# EAGLE design synth-zodiac-scorpio-kbd-mcu (EAGLE 9.6.2)
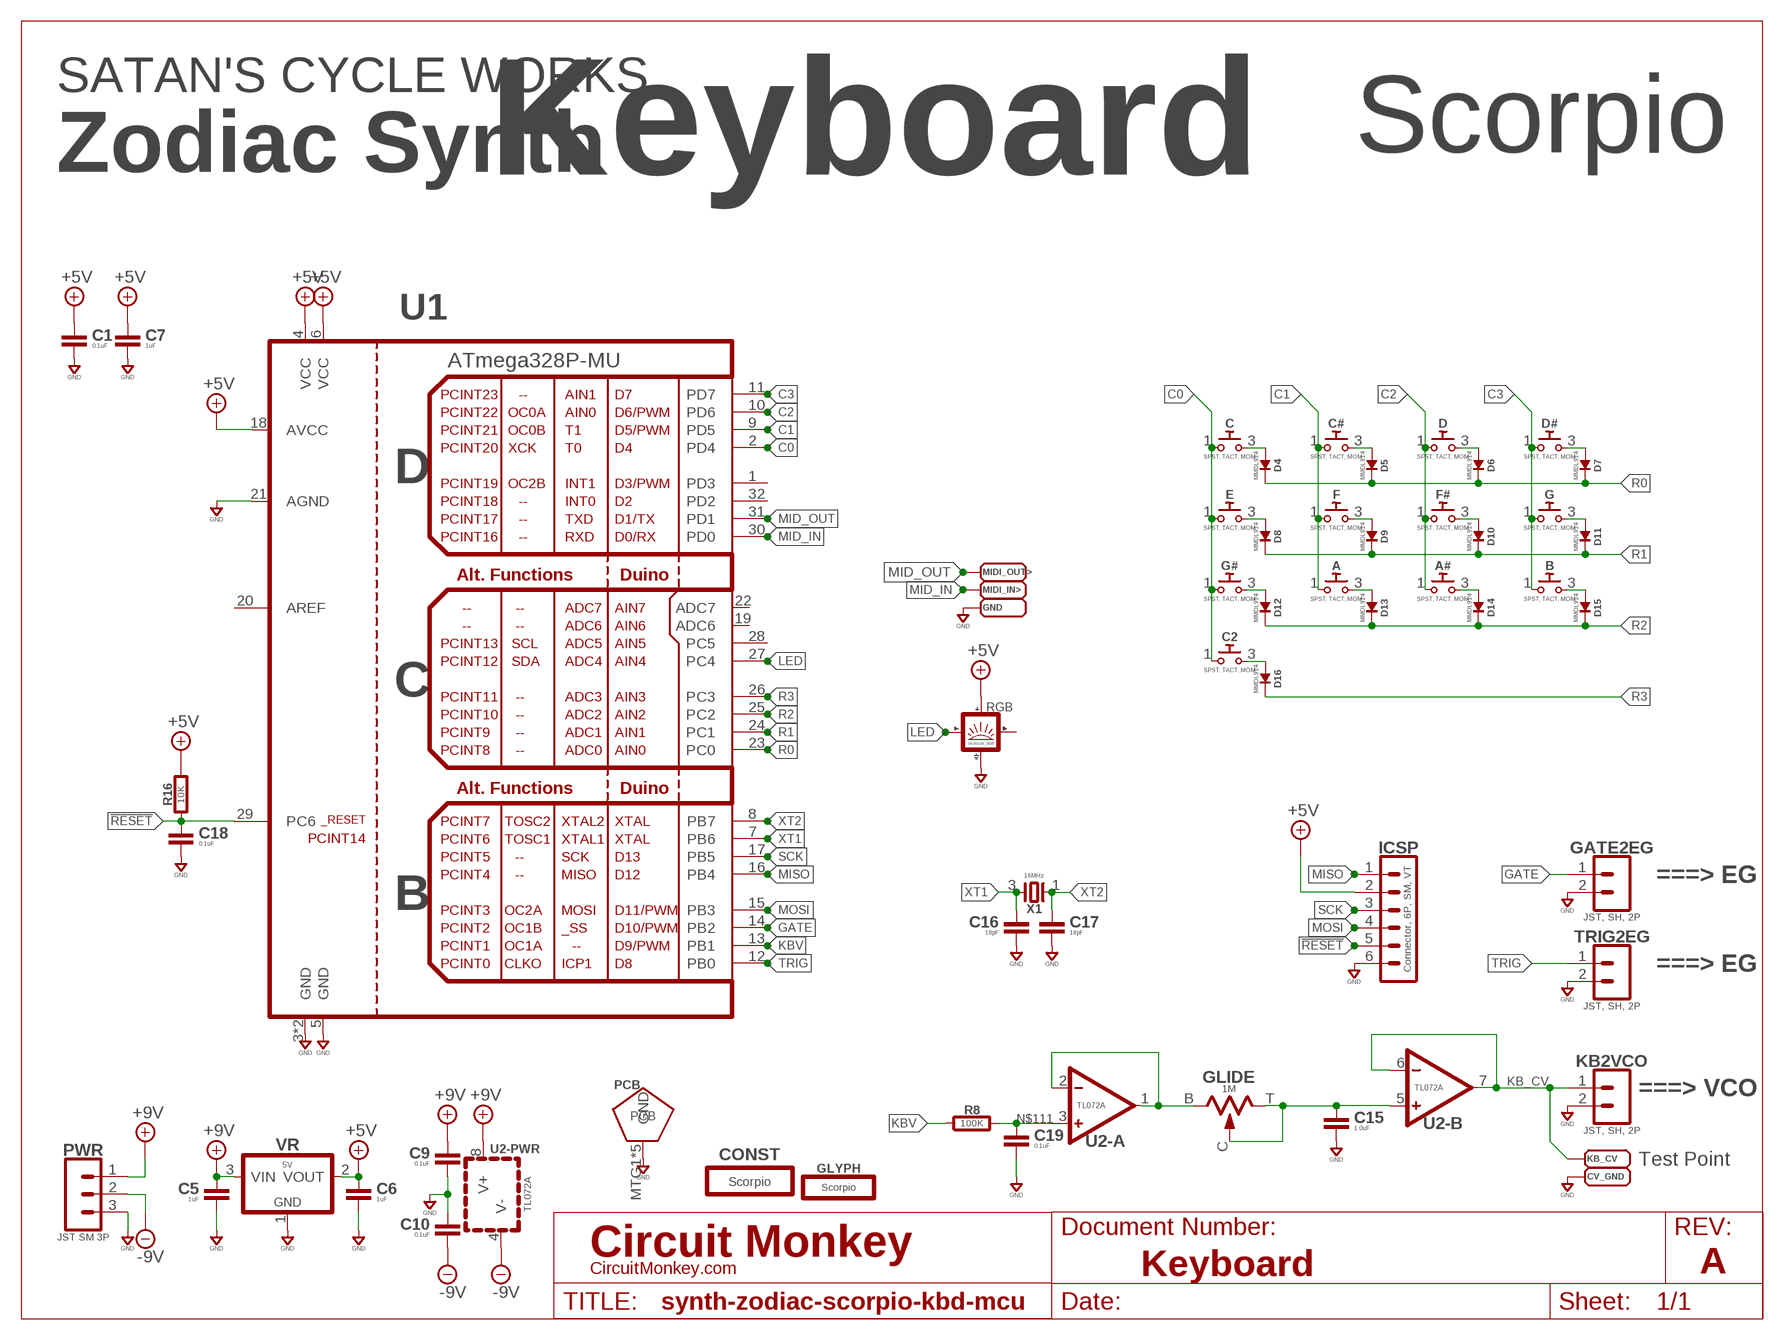
[diagram p0: schematic, sheet 1]
SHEET4 (LETTER_L-CIRCUITMONKEY): DOCUMENT_NUMBER: Keyboard; REV: A

## Parts
A  SPST, TACT, MOM  PUSHBTN-MOMB3FS-BLIND  [B3FS-BACKMOUNT]
A#  SPST, TACT, MOM  PUSHBTN-MOMB3FS-BLIND  [B3FS-BACKMOUNT]
B  SPST, TACT, MOM  PUSHBTN-MOMB3FS-BLIND  [B3FS-BACKMOUNT]
C  SPST, TACT, MOM  PUSHBTN-MOMB3FS-BLIND  [B3FS-BACKMOUNT]
C1  0.1uF  CAPACITOR0603  [0603-CAP]
C2  SPST, TACT, MOM  PUSHBTN-MOMB3FS-BLIND  [B3FS-BACKMOUNT]
C5  1uF  CAPACITOR0603  [0603-CAP]
C6  1uF  CAPACITOR0603  [0603-CAP]
C7  1uF  CAPACITOR0603  [0603-CAP]
C9  0.1uF  CAPACITOR0603  [0603-CAP]
C10  0.1uF  CAPACITOR0603  [0603-CAP]
C15  1.0uF  CAPACITOR0603  [0603-CAP]
C16  18pF  CAPACITOR0603  [0603-CAP]
C17  18pF  CAPACITOR0603  [0603-CAP]
C18  0.1uF  CAPACITOR0603  [0603-CAP]
C19  0.1uF  CAPACITOR0603  [0603-CAP]
C#  SPST, TACT, MOM  PUSHBTN-MOMB3FS-BLIND  [B3FS-BACKMOUNT]
CONST  Scorpio  CONSTELLATION-SCORPIO  [SCORPIO-CONST]
CV_GND  PAD-70X70SMD-070X070  [SMD-070MIL]
D  SPST, TACT, MOM  PUSHBTN-MOMB3FS-BLIND  [B3FS-BACKMOUNT]
D4  MMDL914  DIODE-SWITCHING-SOD323  [SOD-323]
D5  MMDL914  DIODE-SWITCHING-SOD323  [SOD-323]
D6  MMDL914  DIODE-SWITCHING-SOD323  [SOD-323]
D7  MMDL914  DIODE-SWITCHING-SOD323  [SOD-323]
D8  MMDL914  DIODE-SWITCHING-SOD323  [SOD-323]
D9  MMDL914  DIODE-SWITCHING-SOD323  [SOD-323]
D10  MMDL914  DIODE-SWITCHING-SOD323  [SOD-323]
D11  MMDL914  DIODE-SWITCHING-SOD323  [SOD-323]
D12  MMDL914  DIODE-SWITCHING-SOD323  [SOD-323]
D13  MMDL914  DIODE-SWITCHING-SOD323  [SOD-323]
D14  MMDL914  DIODE-SWITCHING-SOD323  [SOD-323]
D15  MMDL914  DIODE-SWITCHING-SOD323  [SOD-323]
D16  MMDL914  DIODE-SWITCHING-SOD323  [SOD-323]
D#  SPST, TACT, MOM  PUSHBTN-MOMB3FS-BLIND  [B3FS-BACKMOUNT]
E  SPST, TACT, MOM  PUSHBTN-MOMB3FS-BLIND  [B3FS-BACKMOUNT]
F  SPST, TACT, MOM  PUSHBTN-MOMB3FS-BLIND  [B3FS-BACKMOUNT]
F#  SPST, TACT, MOM  PUSHBTN-MOMB3FS-BLIND  [B3FS-BACKMOUNT]
G  SPST, TACT, MOM  PUSHBTN-MOMB3FS-BLIND  [B3FS-BACKMOUNT]
G#  SPST, TACT, MOM  PUSHBTN-MOMB3FS-BLIND  [B3FS-BACKMOUNT]
GATE2EG  JST, SH, 2P  02P-SM-VT-SMT  [BM02B-SRSS-TB]
GLIDE  1M  TRIMPOT9MM_PCB_SHAFT  [POT-RV9110]
GLYPH  Scorpio  GLYPH-SCORPIO  [SCORPIO-GLYPH]
GND  PAD-70X70SMD-070X070  [SMD-070MIL]
ICSP  Connector, 6P, SM, VT  06P-SM-VT-SMT  [BM06B-SRSS-TB]
KB2VCO  JST, SH, 2P  02P-SM-VT-SMT  [BM02B-SRSS-TB]
KB_CV  PAD-70X70SMD-070X070  [SMD-070MIL]
MIDI_IN>  PAD-70X70SMD-070X070  [SMD-070MIL]
MIDI_OUT>  PAD-70X70SMD-070X070  [SMD-070MIL]
PCB  PCB FAB  PENTAGON-40R  [PENTAGON-40MM-RAD]
PWR  JST SM 3P  03P-SM-VT-SMT  [BM03B-SRSS-TB]
R8  100K  RESISTOR0603  [0603-RES]
R16  10K  RESISTOR0603  [0603-RES]
RGB  SK2812B_3535  SMART_LED3535  [SMD_3535]
TRIG2EG  JST, SH, 2P  02P-SM-VT-SMT  [BM02B-SRSS-TB]
U1  ATmega328P-MU  ATMEGA328MU  [MLF32]
U2  TL072A  DUALTL072A  [SOP08]
VR  5V  LDO-3P--5V-SOT23  [SOT-23]
X1  16MHz  2P3.2X2.5  [32X25]

## Nets
!RESET: C18.1 ICSP.5 R16.1 U1.29(PC6)
+5V: C1.1 C6.1 C7.1 ICSP.2 R16.2 RGB.4(VDD) U1.4(VCC) U1.6(VCC) U1.18(AVCC) VR.2(VOUT)
+9V: C5.1 C9.1 PWR.1 U2.8(-PWR:V+) VR.3(VIN)
-9V: C10.2 PWR.2 U2.4(-PWR:V-)
C0: C2.1 C.1 E.1 G#.1 U1.2(PD4)
C1: A.1 C#.1 F.1 U1.9(PD5)
C2: A#.1 D.1 F#.1 U1.10(PD6)
C3: B.1 D#.1 G.1 U1.11(PD7)
GATE: GATE2EG.1 U1.14(PB2)
GND: C1.2 C5.2 C6.2 C7.2 C9.2 C10.1 C15.2 C16.2 C17.2 C18.2 C19.2 CV_GND.1(PAD) GATE2EG.2 GND.1(PAD) ICSP.6 KB2VCO.2 PCB.MTG1(GND) PCB.MTG2(GND) PCB.MTG3(GND) PCB.MTG4(GND) PCB.MTG5(GND) PWR.3 RGB.2(GND) TRIG2EG.2 U1.3(GND) U1.5(GND) U1.21(AGND) U1.PAD(GND) VR.1(GND)
KB_CV: KB2VCO.1 KB_CV.1(PAD) U2.6(-B:-) U2.7(-B:OUT)
KBV: R8.1 U1.13(PB1)
LED: RGB.3(IN) U1.27(PC4)
MID_IN: MIDI_IN>.1(PAD) U1.30(PD0)
MID_OUT: MIDI_OUT>.1(PAD) U1.31(PD1)
MISO: ICSP.1 U1.16(PB4)
MOSI: ICSP.4 U1.15(PB3)
N$111: C19.1 R8.2 U2.3(-A:+)
N$119: GLIDE.B U2.1(-A:OUT) U2.2(-A:-)
N$120: C.3 D4.A
N$121: C15.1 GLIDE.C GLIDE.T U2.5(-B:+)
N$122: C#.3 D5.A
N$123: D6.A D.3
N$124: D7.A D#.3
N$125: D8.A E.3
N$126: D9.A F.3
N$127: D10.A F#.3
N$128: D11.A G.3
N$129: D12.A G#.3
N$130: A.3 D13.A
N$131: A#.3 D14.A
N$132: B.3 D15.A
N$133: C2.3 D16.A
R0: D4.K D5.K D6.K D7.K U1.23(PC0)
R1: D8.K D9.K D10.K D11.K U1.24(PC1)
R2: D12.K D13.K D14.K D15.K U1.25(PC2)
R3: D16.K U1.26(PC3)
SCK: ICSP.3 U1.17(PB5)
TRIG: TRIG2EG.1 U1.12(PB0)
XT1: C16.1 U1.7(PB6) X1.3
XT2: C17.1 U1.8(PB7) X1.1
Unconnected: RGB.1(OUT) U1.1(PD3) U1.19(ADC6) U1.20(AREF) U1.22(ADC7) U1.28(PC5) U1.32(PD2)

## Notes on the sheet
- Keyboard | Scorpio
- SATAN'S CYCLE WORKS
- Zodiac Synth
- ===> EG
- ===> EG
- ===> VCO
- Test Point

## Library data of the parts
A A# B C C2 C# D D# E F F# G G# = switch-smd:PUSHBTN-MOM: Pushbutton Switch; COST01: 0.15; COST10: 0.12; COST100: 0.09; MFR: CK; MPN: B3FS; MPN2: Tayda A-3961(2.3mm), A-5134(3.14mm,RA)
C1 C5-C7 C9 C10 C15-C19 = rlc:CAPACITOR: Capacitor; COST01: 0.12; COST10: 0.09; COST100: 0.05
CONST = circuit-monkey-zodiac:CONSTELLATION: Constellations
CV_GND GND KB_CV MIDI_IN> MIDI_OUT> = con-testpoints:PAD-70X70: Solder Pad
D4-D16 = diodes:DIODE-: Diode; MFR: ON Semi; MPN: MMDL914
GATE2EG KB2VCO TRIG2EG = con-jst:02P: 2 pin connector; COST01: 0.45; COST10: 0.4; COST100: 0.35; MFR: JST; MPN: BMB02B-SRSS-TB
GLIDE = rlc:TRIMPOT: Potentiometer; COST01: 0.70; COST10: 0.60; COST100: 0.60; MFR: Tayda; MPN: RV9110NO-OS15A00; SKU: A-5517
GLYPH = circuit-monkey-zodiac:GLYPH: Glyph
ICSP = con-jst:06P: Connector, 6P; COST01: 0.60; COST10: 0.52; COST100: 0.49; MFR: JST; MPN: BM06-SRSS-TB
PCB = circuit-monkey-zodiac:PENTAGON: Pentagram shaped PCB
PWR = con-jst:03P: 3 pin connector; COST01: 0.60; COST10: 0.45; COST100: 0.38; MFR: JST; MPN: BM03B-SRSS-TB
R8 R16 = rlc:RESISTOR: Resistor; COST01: 0.10; COST10: 0.05; COST100: 0.02
RGB = led:SMART_LED: Smart LED SK6812 WS2812; COST01: 0.60; COST10: 0.50; COST100: 0.40
U1 = atmel-atmega:ATMEGA328: Atmega 328P; MFR: Atmel; MPN: atmega328p-mu; OC_MOUSER: 556-ATMEGA328P-MU; OC_SEEED: 310010005
U2 = op-amp:DUAL: Dual Op-Amp; COST01: 0.65; COST10: 0.55; COST100: 0.45; MFR: ST; MPN: TL072A
VR = regulators:LDO-3P-: regulator 3-pin; COST01: 0.66; COST10: 0.56; COST100: 0.39; MFR: Diodes, Inc.; MPN: AP7387-50SA
X1 = xtal:2P: Crystal; MFR: Epson; MPN: FA-238 16.0000MB-K3

## Board
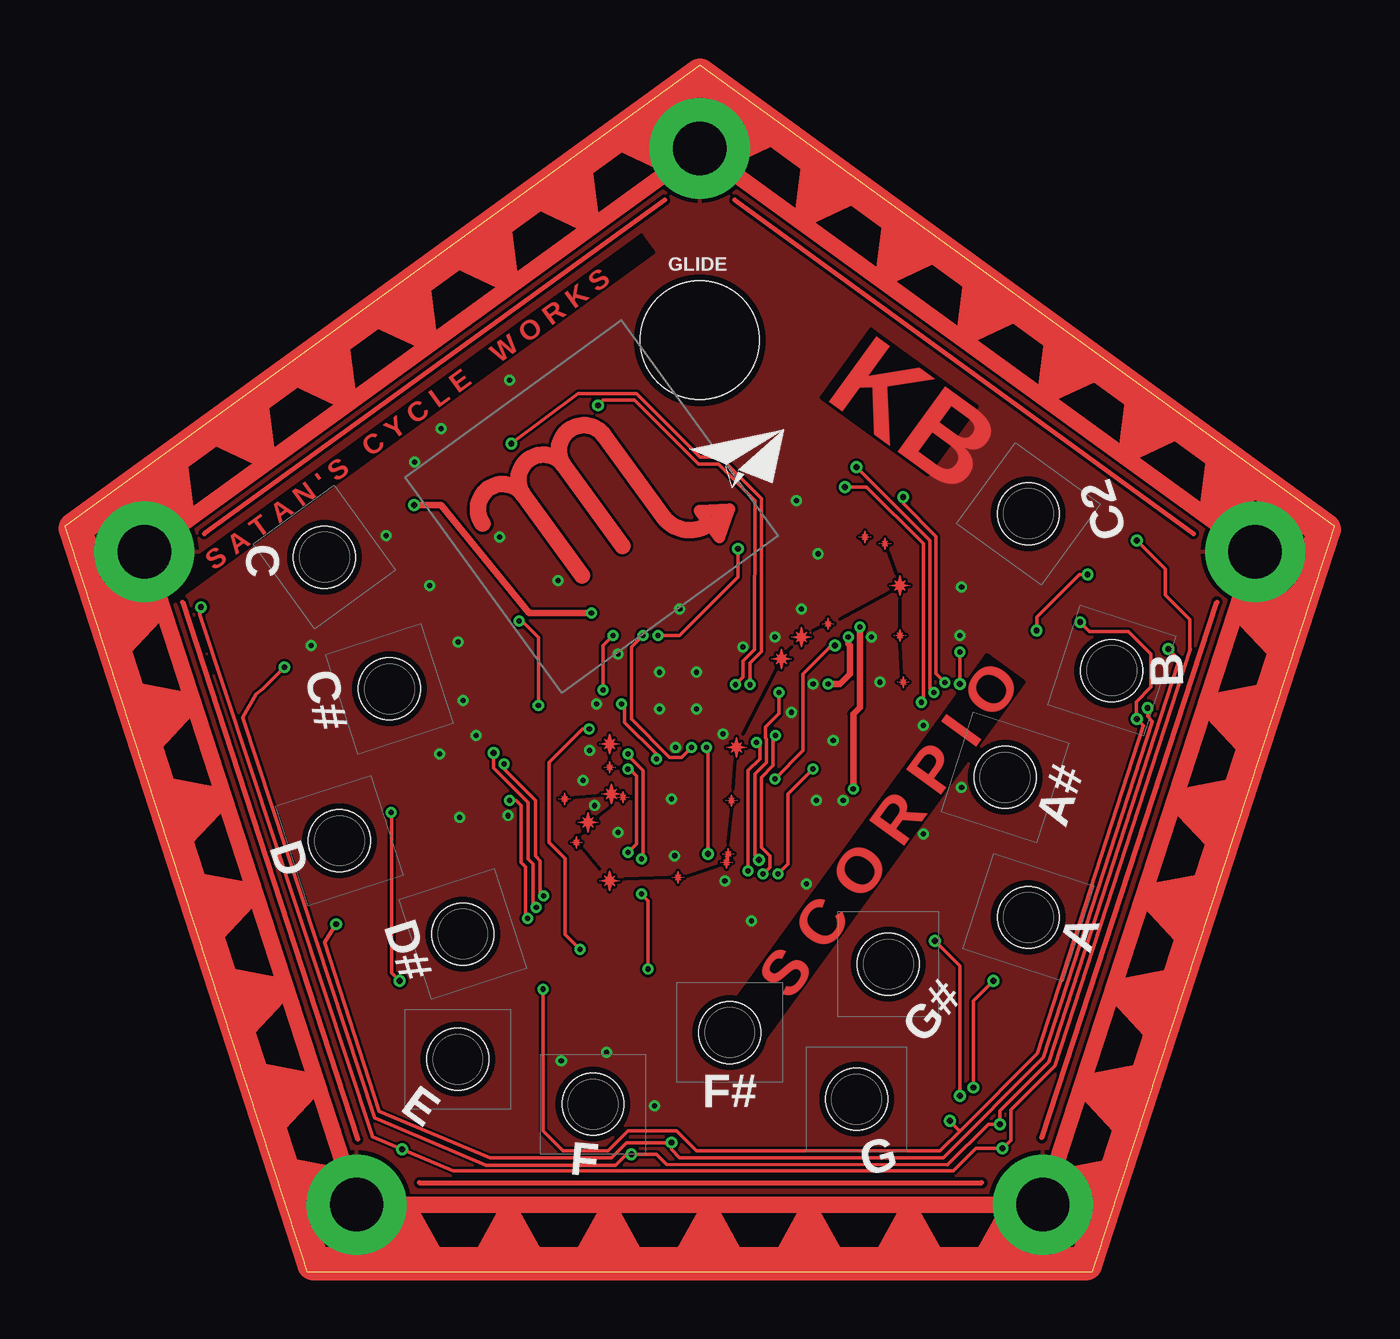
[diagram p1: board, top side]
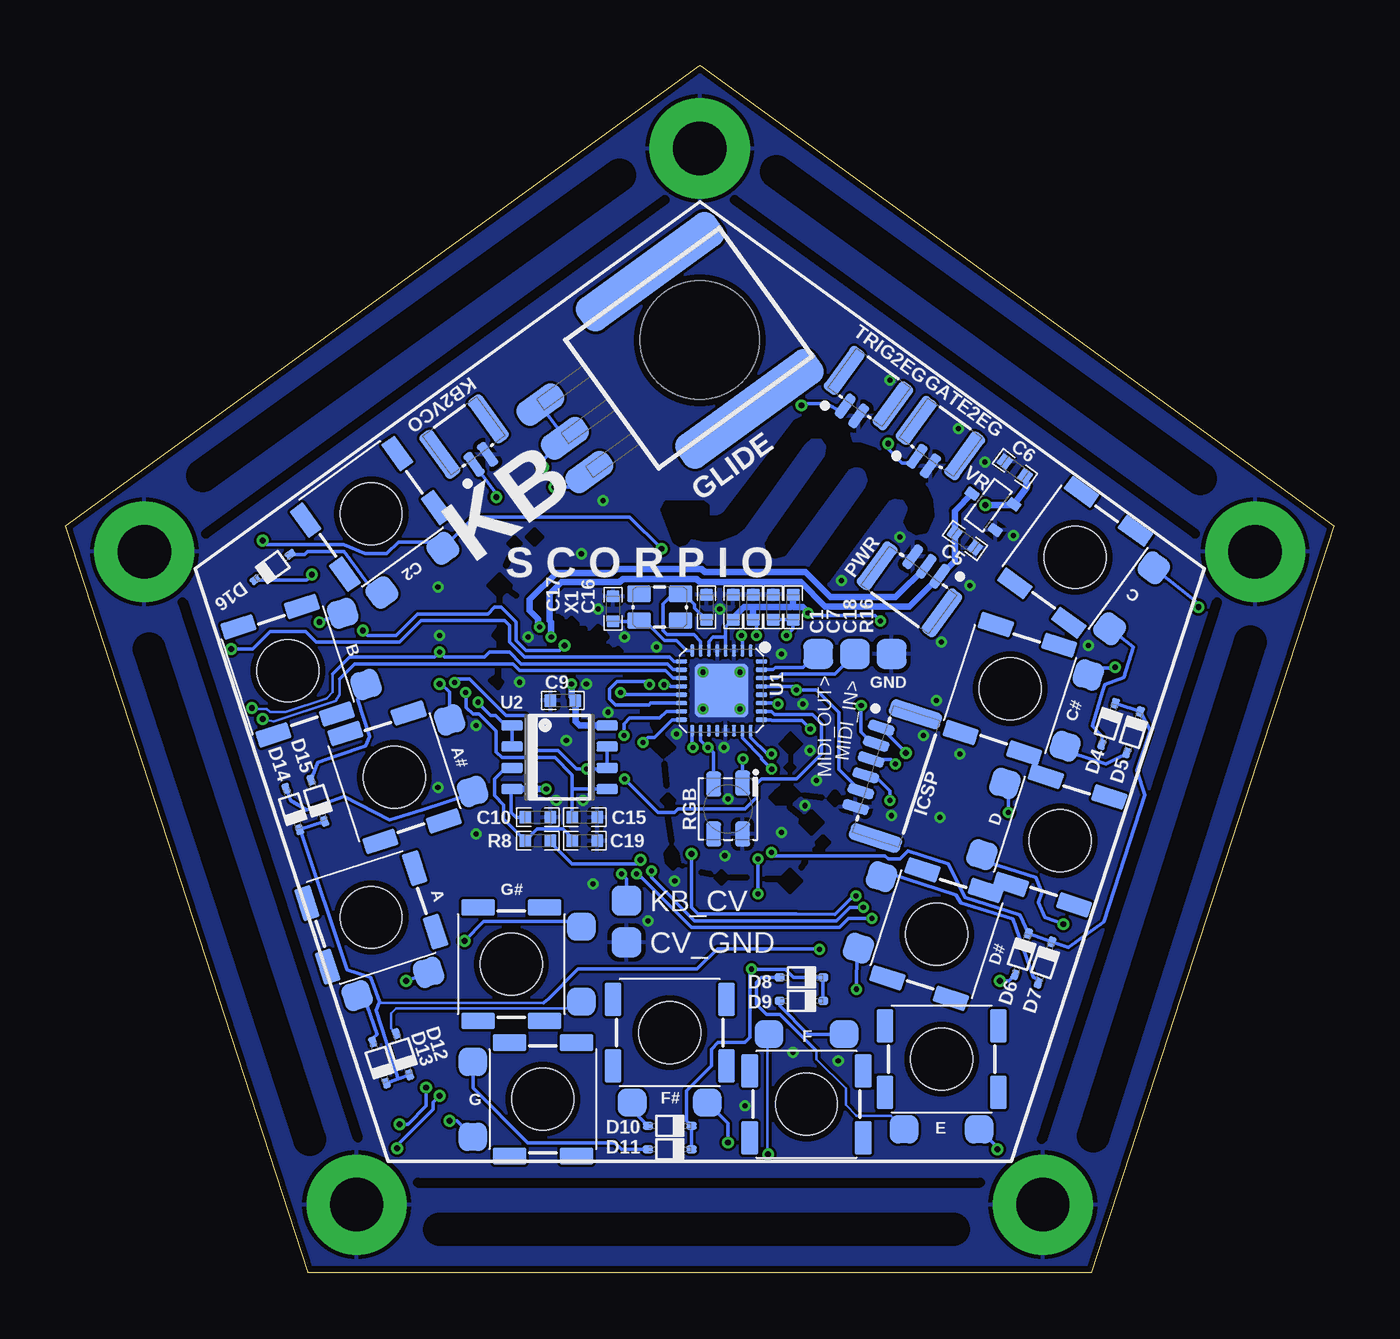
[diagram p2: board, bottom side, seen from below]

Size 76.08 x 72.36 mm. Coordinates in mm from the lower left corner, seen from the top.
Copper layers (1*16): Top 0.0356mm / dielectric 1.5011mm / Bottom 0.0356mm
Design rules "OSH-CircuitMonkey *": minimum track width 6mil, minimum drill 12mil, track to track 6mil, track to pad 6mil, pad to pad 6mil, via to via 6mil, smd to smd 6mil, copper to edge 15mil, drill to drill 6mil, minimum pad ring 7mil, minimum via ring 7mil, stop-mask expansion 3mil, vias tented up to drill 15mil, thermal gap 10mil
bRestrict: area 31.9,30 to 33.2,32.3; area 47.5,43.7 to 48.3,44.5; area 48.8,43.4 to 49.4,44; area 49.4,40.6 to 50.6,41.8; area 49.7,37.9 to 50.3,38.6; area 49.9,35.1 to 50.5,35.7; area 45.4,38.6 to 46,39.2; area 43.6,37.6 to 44.7,38.7; area 42.8,37.2 to 43.1,37.4; area 39.6,28 to 40.2,28.6; area 39.3,24.3 to 40,25.5; area 36.4,23.4 to 37,24; area 32,22.9 to 33.2,24.1; area 30.3,25.5 to 30.9,26.1; area 30.7,26.4 to 31.9,27.6; area 32.1,28.2 to 33.7,29.3; area 29.6,28.1 to 30.2,28.8; area 39.6,31 to 40.7,32.1; area 24.1,41.5 to 40.2,51.4; 28 lines

### Footprints (pad centres in the part's own frame; a part is rotated, then mirrored left to right if it is on the bottom)
B3FS-BACKMOUNT = smd 1.7 x 1.7 bottom: 1 4.2,-2.25; 3 4.2,2.25 | smd 2 x 1 bottom: MT1 -2,3.4; MT2 2,3.4; MT3 -2,-3.4; MT4 2,-3.4 | hole 3.7: 0,0
0603-CAP = smd 0.711 x 0.762: 1 -0.752,0; 2 0.752,0
SMD-070MIL = smd 1.778 x 1.778: 1 0.508,0
SOD-323 = smd 0.6 x 0.45: A 1.3,0; K -1.3,0
BM02B-SRSS-TB = smd 0.6 x 1.6: 1 -0.5,-0.3; 2 0.5,-0.3 | smd 1 x 3.2: MTG1 1.8,1.4; MTG2 -1.8,1.4
POT-RV9110 = smd 1.6 x 3: B 2.5,-10; C 0,-10; T -2.5,-10 | smd 2.286 x 10.16: MNT1 -5.08,0; MNT2 5.08,0 | hole 7.1: 0,0
BM06B-SRSS-TB = smd 0.6 x 1.6: 1 -2.5,-0.3; 2 -1.5,-0.3; 3 -0.5,-0.3; 4 0.5,-0.3; 5 1.5,-0.3; 6 2.5,-0.3 | smd 1 x 3.2: MTG1 3.9,1.4; MTG2 -3.9,1.4
PENTAGON-40MM-RAD = drill 3.2 pad 6: MTG1 0,35; MTG2 33.3,10.82; MTG3 20.57,-28.32; MTG4 -20.57,-28.32; MTG5 -33.3,10.82
BM03B-SRSS-TB = smd 0.6 x 1.6: 1 -1,-0.3; 2 0,-0.3; 3 1,-0.3 | smd 1 x 3.2: MTG1 2.4,1.4; MTG2 -2.4,1.4
0603-RES = smd 0.711 x 0.762: 1 -0.752,0; 2 0.752,0
SMD_3535 = smd 1.5 x 0.9: 1 -1.5,0.875; 2 -1.5,-0.875; 3 1.55,-0.875; 4 1.5,0.875
MLF32 = smd 0.7 x 0.25: 1 -2.4,1.75; 2 -2.4,1.25; 3 -2.4,0.75; 4 -2.4,0.25; 5 -2.4,-0.25; 6 -2.4,-0.75; 7 -2.4,-1.25; 8 -2.4,-1.75; 17 2.4,-1.75; 18 2.4,-1.25; 19 2.4,-0.75; 20 2.4,-0.25; 21 2.4,0.25; 22 2.4,0.75; 23 2.4,1.25; 24 2.4,1.75 | smd 0.25 x 0.7: 9 -1.75,-2.4; 10 -1.25,-2.4; 11 -0.75,-2.4; 12 -0.25,-2.4; 13 0.25,-2.4; 14 0.75,-2.4; 15 1.25,-2.4; 16 1.75,-2.4; 25 1.75,2.4; 26 1.25,2.4; 27 0.75,2.4; 28 0.25,2.4; 29 -0.25,2.4; 30 -0.75,2.4; 31 -1.25,2.4; 32 -1.75,2.4 | smd 3.2 x 3.2: PAD 0,0
SOP08 = smd 0.6 x 1.3: 1 -1.905,-2.85; 2 -0.635,-2.85; 3 0.635,-2.85; 4 1.905,-2.85; 5 1.905,2.85; 6 0.635,2.85; 7 -0.635,2.85; 8 -1.905,2.85
SOT-23 = smd 0.6 x 0.8: 1 0.95,1.2; 2 -0.95,1.2; 3 0,-1.2
32X25 = smd 1.4 x 1: 1 -1.25,-0.8; 2 1.25,-0.8; 3 1.25,0.8; 4 -1.25,0.8

### Placement (x,y rotation side)
A  57.74,21.26 252 top
A#  56.34,29.66 162 top
B  62.74,36.06 162 top
C  15.54,42.86 216 top
C1  36.04,39.86 90 bottom
C2  57.74,45.46 234 top
C5  22.14,43.86 324 bottom
C6  19.14,48.16 144 bottom
C7  34.84,39.86 90 bottom
C9  46.24,34.26 180 bottom
C10  47.74,27.26 180 bottom
C15  44.94,27.26 0 bottom
C16  37.64,39.86 90 bottom
C17  43.24,39.76 90 bottom
C18  33.64,39.86 90 bottom
C19  44.94,25.86 0 bottom
C#  19.44,34.96 198 top
CONST  41.14,36.76 90 top
CV_GND  42.94,19.76 0 bottom
D  16.44,25.86 18 top
D4  13.54,32.86 252 bottom
D5  12.04,32.36 252 bottom
D6  18.74,19.06 252 bottom
D7  17.34,18.56 252 bottom
D8  31.94,17.66 180 bottom
D9  31.94,16.26 180 bottom
D10  39.84,8.76 180 bottom
D11  39.84,7.36 180 bottom
D12  55.84,13.06 108 bottom
D13  57.24,12.56 108 bottom
D14  62.44,27.76 108 bottom
D15  60.94,28.26 108 bottom
D16  63.64,42.26 36 bottom
D#  23.84,20.26 18 top
E  23.54,12.76 270 top
F  31.64,10.06 90 top
F#  39.84,14.36 270 top
G  47.44,10.36 0 top
G#  49.34,18.46 180 top
GATE2EG  24.44,48.86 324 bottom
GLIDE  38.04,55.86 306 bottom
GLYPH  31.64,45.96 36 top
GND  26.54,37.56 270 bottom
ICSP  27.64,30.16 252 bottom
KB2VCO  51.34,48.96 36 bottom
KB_CV  42.94,22.26 0 bottom
MIDI_IN>  28.74,37.56 270 bottom
MIDI_OUT>  30.94,37.56 270 bottom
PCB  38.04,32.36 0 top
PWR  24.64,42.06 144 bottom
R8  47.74,25.86 180 bottom
R16  32.44,39.86 90 bottom
RGB  36.34,27.76 90 bottom
TRIG2EG  28.74,51.86 324 bottom
U1  36.74,34.86 270 bottom
U2  46.44,30.86 270 bottom
VR  20.74,45.96 234 bottom
X1  40.44,39.86 0 bottom

### Tracks (layer width: path | path; a pad name or v marks a point on that pad's centre or on a via)
!RESET  (via drill 0.3)
  Top 0.2: v32.24,34.91 32.24,37.57 v32.84,38.17
  Bottom 0.2: C18.1 R16.1 32.44,38.56 v32.84,38.17 | U1.29 32.45,35.11 v32.24,34.91 31.04,34.91 29.69,33.56 29.69,30.13 ICSP.5
+5V  (via drill 0.3, 0.35)
  Top 0.2: v37.54,31.46 36.94,30.86 36.24,30.86 33.94,33.16 33.94,37.46 v34.64,38.16 | v27.21,39.03 27.38,39.03 28.36,38.04 v28.36,33.97
  Top 0.4: v31.54,39.51 27.82,39.51 22.52,45.98 v20.92,45.98
  Bottom 0.2: C1.1 36.49,38.66 36.49,38.06 | U1.6 37.49,37.81 37.24,38.06 36.49,38.06 | RGB.4 37.22,31.14 v37.54,31.46 37.59,31.46 37.99,31.87 U1.18 | v31.54,39.51 31.39,39.36 27.54,39.36 v27.21,39.03 | ICSP.2 27.66,31.68 28.36,32.38 v28.36,33.97 | v34.64,38.16 34.64,38.91 C7.1 | U1.4 36.49,38.06
  Bottom 0.4: C1.1 36.04,39.21 35.39,39.86 34.84,39.86 | 34.84,39.86 32.59,39.86 32.44,40.01 R16.2 32.44,39.91 32.39,39.86 31.84,39.86 31.54,39.56 v31.54,39.51 | v20.92,45.98 19.26,45.98 VR.2 18.44,47.06 C6.1 | C7.1 34.84,39.86
+9V  (via drill 0.3)
  Top 0.4: v46.94,38.06 46.94,37.66 47.04,37.56 47.04,35.86 46.44,35.26 v45.74,35.26
  Bottom 0.4: VR.3 22.75,45.63 C5.1 22.75,42.62 PWR.1 25.46,39.91 30.52,39.91 31.97,41.36 38.04,41.36 38.24,41.56 42.64,41.56 42.84,41.36 46.34,41.36 47.04,40.66 47.04,39.06 46.94,38.96 v46.94,38.06 | v45.74,35.26 45.74,34.51 C9.1 45.49,33.01 45.25,32.77 U2.8
-9V  (via drill 0.3)
  Top 0.4: v47.64,38.66 47.64,33.86 47.24,33.46 v47.24,28.96
  Bottom 0.2: 49.22,28.88 U2.4 49.34,28.91 49.34,27.56 49.04,27.26 C10.2
  Bottom 0.4: PWR.2 26.31,40.46 30.19,40.46 31.69,41.96 37.74,41.96 37.94,42.16 43.04,42.16 43.29,41.91 46.64,41.91 48.24,40.31 48.24,39.66 47.74,39.16 47.74,38.76 v47.64,38.66 | v47.24,28.96 49.14,28.96 49.22,28.88
C0  (via drill 0.3, 0.35)
  Top 0.2: v35.54,38.16 36.84,38.16 40.34,41.66 v40.34,43.36 | v64.24,43.86 65.94,42.16 65.94,40.6 67.42,39.12 67.42,37.38 67.44,37.36 59.34,12.36 56.69,9.71 56.69,7.91 v56.19,7.41 54.59,7.41 53.24,6.06 23.25,6.06 v20.2,7.36 18.43,8.11 8.06,39.42 v8.14,39.86 | v53.64,10.56 53.64,18.36 v52.14,19.86
  Bottom 0.2: U1.2 35.49,38.11 v35.54,38.16 | v40.34,43.36 42.24,45.26 51.58,45.26 C2.1 53.83,43.76 56.1,43.76 56.8,43.06 58.09,43.06 59.38,43.62 64,43.62 v64.24,43.86 | v52.14,19.86 50.99,21.01 45.44,21.01 G#.1 | v56.19,7.41 56.19,7.61 54.04,9.76 54.04,10.16 v53.64,10.56 | v8.14,39.86 8.35,40.26 C.1 | E.1 20.2,7.47 v20.2,7.36
C1  (via drill 0.35)
  Top 0.2: v13.14,36.26 11.84,34.96 11.44,34.66 10.64,33.26 18.56,9.24 25.24,6.41 32.99,6.41 33.64,7.06 v33.94,7.06 35.44,7.06 36.04,6.47 52.9,6.42 55.34,8.86 v56.04,8.86 56.04,9.66 58.98,12.6 66.74,36.55 66.74,36.75 v66.13,37.35 | v55.64,17.46 54.44,16.26 v54.44,11.06
  Bottom 0.16: F.1 33.97,14.18 33.97,7.09 v33.94,7.06
  Bottom 0.2: U1.9 39.59,36.61 39.84,36.86 48.54,36.86 49.44,37.76 49.44,38.76 49.74,39.06 54.74,39.06 56.04,37.76 61.04,37.76 61.68,38.4 63.78,38.4 64.83,37.35 v66.13,37.35 | v13.14,36.26 13.16,36.2 14.35,36.2 C#.1 | A.1 54.54,17.86 v55.64,17.46 | v54.44,11.06 54.44,9.96 55.54,8.86 v56.04,8.86
C2  (via drill 0.3, 0.35)
  Top 0.2: v64.89,33.81 64.89,33.31 65.19,33.01 58.64,12.86 52.64,6.86 36.84,6.86 36.34,7.36 v36.34,7.76 33.64,7.76 32.74,6.86 25.48,6.86 18.81,9.64 15.54,19.76 v16.24,20.86 | v53.64,37.16 v53.64,35.26
  Bottom 0.16: 60.04,35.86 60.04,34.76 60.41,34.39 62.86,33.57 63.8,33.57 63.99,33.77 64.84,33.77
  Bottom 0.2: U1.10 39.64,36.11 39.99,36.46 48.74,36.46 49.44,37.16 50.64,37.16 50.94,36.86 53.34,36.86 v53.64,37.16 53.94,36.86 59.04,36.86 60.04,35.86 | 64.84,33.77 v64.89,33.81 | A#.1 53.04,34.76 53.54,35.26 v53.64,35.26 | F#.1 36.34,8.91 v36.34,7.76 | D.1 20.64,24.53 17.9,23.67 17.54,22.76 17.74,22.16 17.34,21.26 v16.24,20.86
C3  (via drill 0.3, 0.35)
  Top 0.2: 53.69,8.51 58.29,13.11 64.64,32.76 v64.24,33.16 64.21,33.19 64.21,34.19 65.08,35.06 65.08,37.05 63.72,38.41 61.39,38.41 v60.84,38.96 | 53.69,8.51 52.44,7.26 37.84,7.26 36.64,8.46 33.74,8.46 32.54,7.26 29.84,7.26 28.64,8.46 v28.64,16.96 | v53.04,9.06 53.59,8.51 53.69,8.51
  Bottom 0.16: 59.64,35.56 59.64,34.63 59.88,34.23 63.58,32.99 v64.24,33.16
  Bottom 0.2: U1.11 39.64,35.61 40.09,36.06 48.84,36.06 49.24,36.46 58.74,36.46 59.64,35.56 | D#.1 28.63,19.32 v28.64,16.96 | B.1 59.51,39.44 60.84,39 v60.84,38.96 | G.1 52.59,9.06 v53.04,9.06
GATE  (via drill 0.3, 0.35)
  Top 0.2: v41.04,35.21 41.04,36.51 41.74,37.21 41.74,46.36 39.24,48.86 38.04,48.86 34.24,52.66 30.74,52.66 v26.74,49.66
  Bottom 0.2: v41.04,35.21 41.24,35.41 42.99,35.41 43.44,34.96 43.44,34.36 43.09,34.01 41.09,34.01 40.99,34.11 U1.14 | v26.74,49.66 26.74,49.33 25.92,48.51 25.42,48.51 GATE2EG.1
GND  (via drill 0.3)
  other vias: 40.64,37.46 36.59,31.46 35.64,33.76 37.84,33.76 37.84,35.96 35.64,35.96 36.84,39.76 44.14,39.76 42.54,38.06 46.64,28.26 45.04,28.26 44.44,23.26 32.44,13.16 35.34,9.96 29.74,12.66 14.74,37.56 53.64,38.16 24.64,32.16 23.64,27.26 22.44,31.06 33.14,26.36 48.84,35.36 44.84,35.26 45.14,43.06 53.74,41.06 43.84,46.26 31.04,29.46 48.34,38.06 53.74,29.06 51.44,32.76 51.44,26.26 46.04,31.86 23.54,37.76 23.84,34.26 39.44,32.26 36.54,24.96 26.04,44.06 29.54,41.46 26.64,53.46 22.54,50.56 20.94,48.56 19.24,44.16 21.84,41.16 41.14,21.06 33.14,37.06 31.84,34.06 31.74,27.96 26.54,27.36 31.44,31.26 36.34,28.36 39.54,23.46 43.54,33.56
  pour Top (rank 4): 17.44,3.96 58.64,3.96 71.44,43.16 38.04,67.56 4.64,43.16
  pour Bottom: 14.64,0.16 61.44,0.16 75.84,44.56 75.84,44.76 38.04,72.16 0.24,44.76 0.24,44.36
KB_CV  (via drill 0.3, 0.35)
  Top 0.2: v50.24,46.46 50.24,46.06 52.19,44.11 52.19,35.89 v52.75,35.34 | v44.83,30.17 43.33,28.67 43.33,24.46 v42.73,23.86
  Bottom 0.2: KB2VCO.1 50.31,46.76 v50.24,46.46 | KB_CV.1 42.43,23.56 v42.73,23.86 | U2.7 U2.6 43.53,30.17 v44.83,30.17 45.43,30.17 46.54,31.26 47.94,31.26 48.34,31.66 48.34,33.18 48.53,33.36 49.64,33.36 51.84,35.56 52.53,35.56 v52.75,35.34
KBV  (via drill 0.3, 0.35)
  Top 0.2: v41.59,24.71 41.34,24.96 41.34,29.86 42.04,30.56 42.04,31.96 41.99,32.01 41.99,32.68 42.79,33.48 v42.79,34.76
  Bottom 0.2: U1.13 42.94,34.61 v42.79,34.76 | v41.59,24.71 41.84,24.46 45.69,24.46 46.99,25.76 R8.1
LED  (via drill 0.3)
  Top 0.2: v33.34,34.06 33.54,33.86 33.54,32.96 35.44,31.06 v35.44,30.76
  Bottom 0.2: U1.27 33.59,34.11 33.54,34.06 v33.34,34.06 | v35.44,30.76 35.47,30.74 RGB.3
MID_IN
  Bottom 0.2: U1.30 33.39,35.61 33.14,35.86 29.93,35.86 MIDI_IN>.1
MID_OUT
  Bottom 0.2: U1.31 33.64,36.11 33.5,36.25 31.84,36.25 31.04,37.05 MIDI_OUT>.1
MISO  (via drill 0.3, 0.35)
  Top 0.2: v41.44,31.76 41.64,31.56 41.64,30.76 40.94,30.06 v40.94,24.06 | v25.68,31.12 25.68,30.22 27.74,28.16 27.74,24.77 28.04,24.46 28.04,22.06 v28.24,21.86
  Bottom 0.2: U1.16 39.69,33.11 40.74,32.06 41.14,32.06 v41.44,31.76 | v40.94,24.06 40.94,23.66 38.34,21.06 29.84,21.06 29.04,21.86 v28.24,21.86 | ICSP.1 25.68,31.16 v25.68,31.12
MOSI  (via drill 0.3)
  Top 0.2: v42.59,32.16 42.44,32.01 42.44,30.36 41.74,29.66 41.74,25.46 42.24,24.96 42.24,24.26 v41.84,23.86 | v26.64,28.26 27.04,28.26 27.34,27.96 27.34,24.57 27.61,24.3 27.61,21.3 v27.71,21.2
  Bottom 0.2: U1.15 40.04,33.61 40.44,33.21 42.24,33.21 42.59,32.86 v42.59,32.16 | v41.84,23.86 41.64,23.66 41.54,23.66 38.54,20.66 29.65,20.66 29.11,21.2 v27.71,21.2 | v26.64,28.26 26.64,28.84 27.38,29.58 27.88,29.58 ICSP.4
N$111
  Bottom 0.2: U2.3 49.68,30.23 50.34,29.56 50.34,28.56 49.79,28.01 49.79,27.16 R8.2 47.79,26.56 46.24,26.56 45.69,26.01 C19.1
N$119  (via drill 0.3, 0.35)
  Top 0.2: v46.74,47.06 48.04,47.06 51.44,43.66 51.44,34.26 v51.34,34.16
  Bottom 0.2: GLIDE.B 45.56,47.06 v46.74,47.06 | U2.2 U2.1 49.69,32.77 50.29,33.37 50.59,33.37 51.34,34.12 v51.34,34.16
N$120
  Bottom 0.2: C.3 12.06,37.46 12.62,35.65 13.77,35.23 13.91,34.79 14.5,32.75 13.94,32.12 D4.A
N$121  (via drill 0.3, 0.35)
  Top 0.2: v47.44,48.26 51.84,43.86 51.84,34.99 v52.07,34.76
  Bottom 0.2: v47.44,48.26 47.44,48.67 GLIDE.C GLIDE.T | v52.07,34.76 52.04,34.72 52.04,33.86 51.64,33.46 51.28,33.46 50.24,32.42 50.24,31.19 49.89,30.84 46.73,30.84 45.69,29.81 45.69,28.96 | C15.1 45.69,28.96 | U2.5 45.69,28.96
N$122
  Bottom 0.2: C#.3 15.74,31.12 13.69,30.45 12.96,30.82 12.53,31.04 D5.A
N$123  (via drill 0.3, 0.35)
  Top 0.2: v19.54,27.56 19.57,27.53 19.57,17.93 v20.04,17.46
  Bottom 0.2: D.3 19.54,29.1 v19.54,27.56 | v20.04,17.46 19.51,17.46 D6.A
N$124
  Bottom 0.2: D#.3 26.94,23.9 26.66,23.9 22.67,22.6 22.38,22.13 19.27,21.16 18.03,17.68 17.74,17.58 D7.A
N$125
  Bottom 0.16: E.3 26.59,9.36 28.64,9.36 29.29,10.01 29.29,11.01 31.04,12.76 31.04,13.26
  Bottom 0.2: D8.A 34.34,17.66 34.64,17.36 34.64,16.06 34.04,15.46 33.24,15.46 31.04,13.26
N$126
  Bottom 0.2: D9.A 33.24,15.96 31.54,14.26 F.3
N$127
  Bottom 0.2: D10.A 42.09,9.71 F#.3
N$128
  Bottom 0.2: D11.A 42.74,7.36 43.14,7.76 48.36,7.76 51.64,11.05 G.3
N$129
  Bottom 0.16: D12.A 56.54,14.6 56.54,15.5 56.24,15.8 45.79,15.8
  Bottom 0.2: 45.79,15.8 G#.3
N$130
  Bottom 0.2: A.3 57.98,15.97 57.4,14.24 57.64,14 D13.A
N$131
  Bottom 0.2: A#.3 51.84,28.63 54.7,27.71 56.62,27.1 59.36,28.53 61.61,27.7 62.55,28.27 D14.A
N$132
  Bottom 0.2: B.3 58.05,34.82 58.55,34.32 57.82,32.1 58.06,31.54 59.74,30.96 60.94,30.56 D15.A
N$133
  Bottom 0.2: D16.A 61.73,43.02 61.55,43.2 59.35,43.2 57.53,40.71 C2.3
R0  (via drill 0.3)
  Top 0.2: v33.73,30.15 33.85,30.15 34.25,29.75 34.25,25.67 v33.74,25.16
  Bottom 0.2: U1.23 35.49,32.01 34.33,30.85 34.33,30.75 v33.73,30.15 | D4.K 13.01,34.06 D5.K 11.04,32.46 11.84,30.06 11.36,28.6 13.81,20.98 15.94,19.46 D7.K D6.K 18.84,21.42 22.14,22.47 23.14,24.46 25.57,25.24 26.04,24.76 26.74,24.76 26.94,24.96 33.54,24.96 v33.74,25.16
R1  (via drill 0.3)
  Top 0.2: v34.54,24.76 34.64,24.86 34.64,30.06 33.74,30.96 v33.74,31.06 | v34.54,22.66 34.94,22.26 v34.94,18.16
  Bottom 0.2: U1.24 34.99,32.06 33.99,31.06 v33.74,31.06 | v34.54,24.76 v34.54,22.66 | D9.K D8.K 32.43,17.66 32.9,18.14 34.92,18.14 v34.94,18.16 35.04,18.06 35.04,14.06 35.34,13.76 36.94,13.76 37.34,13.36 37.34,12.36 38.84,10.86 38.84,9.06 D10.K D11.K
R2  (via drill 0.3)
  Top 0.2: v30.87,19.36 29.97,20.26 29.97,24.79 29.02,25.75 29.02,30.56 31.02,32.56 v31.42,32.56
  Bottom 0.16: 47.4,16.14 57.25,16.14
  Bottom 0.2: U1.25 33.77,33.11 33.72,33.06 31.92,33.06 v31.42,32.56 | v30.87,19.36 30.88,19.37 36.99,19.37 38.2,18.16 45.34,18.16 47.09,16.41 47.4,16.14 | D15.K D14.K 61.99,26.47 61.94,26.36 59.19,18.11 57.77,17.66 57.23,16.19 57.25,16.14 57.44,15.69 56.24,11.96 56.11,11.58 | D13.K 56.11,11.58 | 56.11,11.58 D12.K
R3  (via drill 0.3, 0.35)
  Top 0.2: v46.14,37.56 45.94,37.56 44.24,35.86 44.24,31.26 v42.54,29.56 | v61.29,41.81 60.79,41.81 58.24,39.26 v58.24,38.46
  Bottom 0.2: U1.26 33.74,33.61 33.57,33.44 31.29,33.44 30.74,32.89 30.74,31.06 32.24,29.56 34.34,29.56 34.64,29.26 34.64,28.46 35.34,27.76 39.34,27.76 39.54,27.56 40.54,27.56 v42.54,29.56 | v58.24,38.46 57.94,38.16 56.24,38.16 54.94,39.46 50.74,39.46 50.34,39.86 49.94,39.86 49.04,38.96 49.04,37.86 48.44,37.26 46.44,37.26 v46.14,37.56 | v61.29,41.81 61.61,41.5 D16.K
SCK  (via drill 0.3, 0.35)
  Top 0.2: v38.54,25.06 38.54,31.28 38.44,31.39 v38.44,31.46 | v26.31,30.46 26.31,30.16 28.2,28.27 28.19,24.96 28.48,24.66 28.48,22.76 v28.68,22.56
  Bottom 0.2: U1.17 38.49,31.51 v38.44,31.46 | v26.31,30.46 26.57,30.73 ICSP.3 | v28.68,22.56 28.84,22.56 29.95,21.45 32.23,21.46 38.14,21.46 38.54,21.86 v38.54,25.06
TRIG  (via drill 0.3, 0.35)
  Top 0.2: v40.19,35.21 40.64,35.66 40.64,36.64 41.32,37.32 41.34,46.26 39.17,48.43 37.97,48.43 34.14,52.26 32.24,52.26 v31.94,51.96
  Bottom 0.2: U1.12 39.79,35.11 39.89,35.21 v40.19,35.21 | v31.94,51.96 31.84,52.07 30.43,52.08 29.59,51.59 TRIG2EG.1
XT1
  Bottom 0.2: U1.7 37.99,37.81 38.39,38.21 39.99,38.21 40.24,38.46 40.24,40.06 39.64,40.66 X1.3 39.09,40.56 38.89,40.56 38.34,40.01 38.34,39.81 C16.1
XT2
  Bottom 0.2: U1.8 38.84,37.26 39.44,37.86 40.14,37.86 41.34,39.06 X1.1 41.74,39.01 C17.1

### Text on the board
Top: KB | S A T A N ' S C Y C L E W O R K S | S C O R P I O
bPlace: KB | S C O R P I O
tStop: KB | S A T A N ' S C Y C L E W O R K S | S C O R P I O